# EAGLE design 3_Channel_Preprocessor (EAGLE 8.0.0)
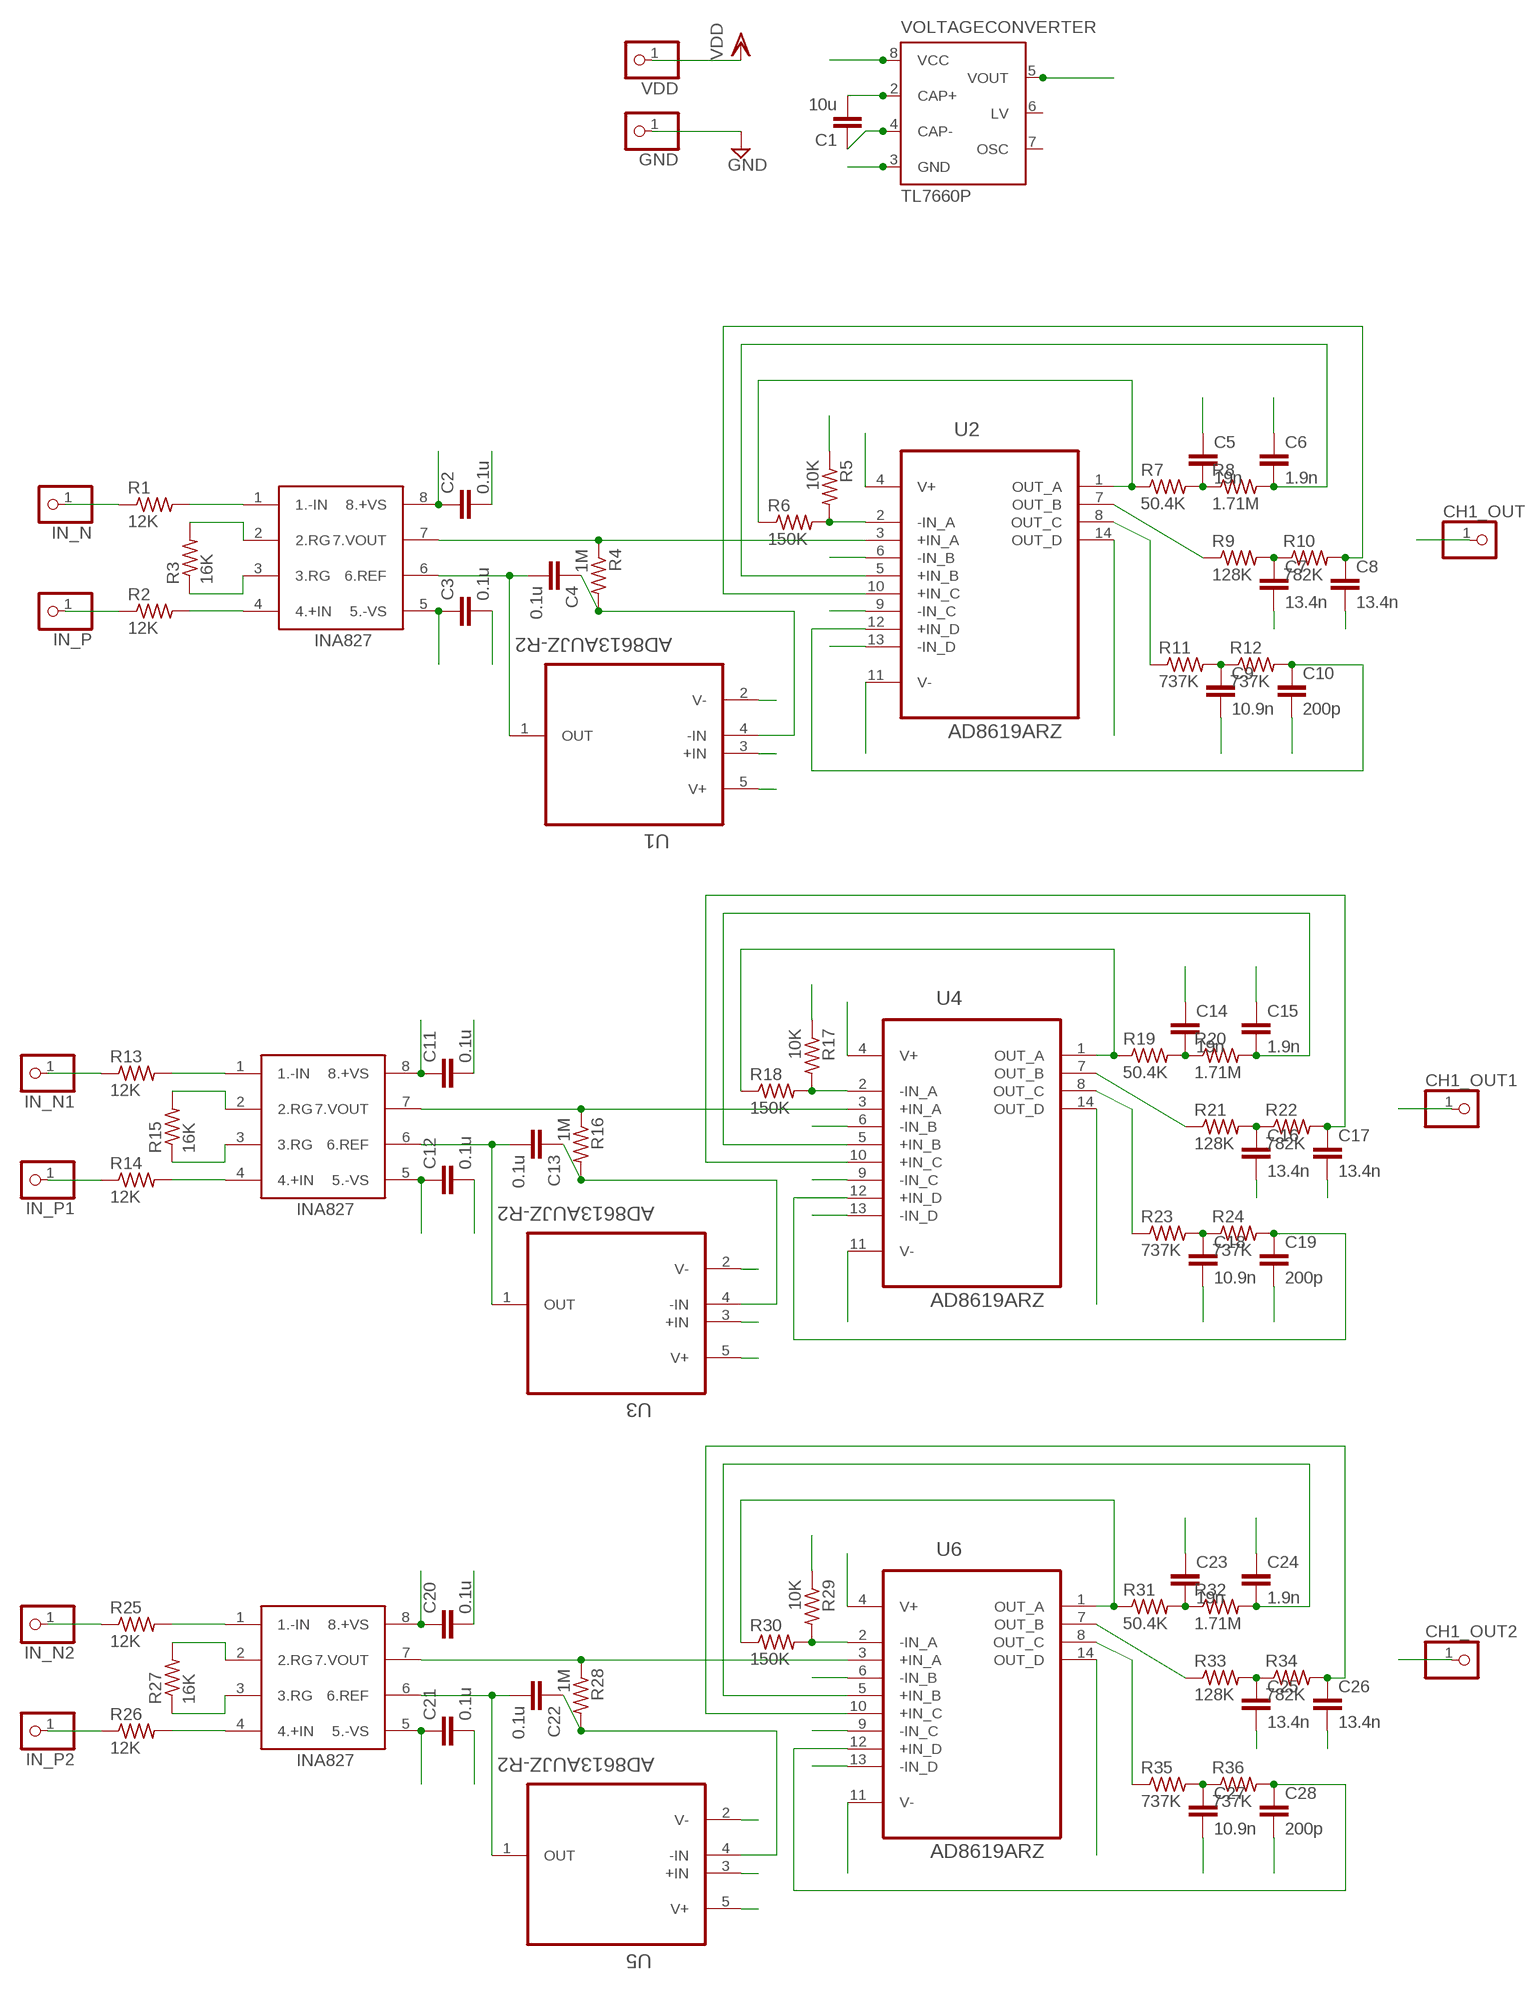
[diagram p0: schematic, sheet 1]

## Parts
C1  10u  C-EUC1206  [C1206]
C2  0.1u  C-EUC1206  [C1206]
C3  0.1u  C-EUC1206  [C1206]
C4  0.1u  C-EUC1206  [C1206]
C5  19n  C-EUC1206  [C1206]
C6  1.9n  C-EUC1206  [C1206]
C7  13.4n  C-EUC1206  [C1206]
C8  13.4n  C-EUC1206  [C1206]
C9  10.9n  C-EUC1206  [C1206]
C10  200p  C-EUC1206  [C1206]
C11  0.1u  C-EUC1206  [C1206]
C12  0.1u  C-EUC1206  [C1206]
C13  0.1u  C-EUC1206  [C1206]
C14  19n  C-EUC1206  [C1206]
C15  1.9n  C-EUC1206  [C1206]
C16  13.4n  C-EUC1206  [C1206]
C17  13.4n  C-EUC1206  [C1206]
C18  10.9n  C-EUC1206  [C1206]
C19  200p  C-EUC1206  [C1206]
C20  0.1u  C-EUC1206  [C1206]
C21  0.1u  C-EUC1206  [C1206]
C22  0.1u  C-EUC1206  [C1206]
C23  19n  C-EUC1206  [C1206]
C24  1.9n  C-EUC1206  [C1206]
C25  13.4n  C-EUC1206  [C1206]
C26  13.4n  C-EUC1206  [C1206]
C27  10.9n  C-EUC1206  [C1206]
C28  200p  C-EUC1206  [C1206]
CH1_OUT  PINHD-1X1  [1X01]
CH1_OUT1  PINHD-1X1  [1X01]
CH1_OUT2  PINHD-1X1  [1X01]
GND  PINHD-1X1  [1X01]
IN_N  PINHD-1X1  [1X01]
IN_N1  PINHD-1X1  [1X01]
IN_N2  PINHD-1X1  [1X01]
IN_P  PINHD-1X1  [1X01]
IN_P1  PINHD-1X1  [1X01]
IN_P2  PINHD-1X1  [1X01]
INA1  INA827  [INA827]
R1  12K  R-US_M1206  [M1206]
R2  12K  R-US_M1206  [M1206]
R3  16K  R-US_M1206  [M1206]
R4  1M  R-US_M1206  [M1206]
R5  10K  R-US_M1206  [M1206]
R6  150K  R-US_M1206  [M1206]
R7  50.4K  R-US_M1206  [M1206]
R8  1.71M  R-US_M1206  [M1206]
R9  128K  R-US_M1206  [M1206]
R10  782K  R-US_M1206  [M1206]
R11  737K  R-US_M1206  [M1206]
R12  737K  R-US_M1206  [M1206]
R13  12K  R-US_M1206  [M1206]
R14  12K  R-US_M1206  [M1206]
R15  16K  R-US_M1206  [M1206]
R16  1M  R-US_M1206  [M1206]
R17  10K  R-US_M1206  [M1206]
R18  150K  R-US_M1206  [M1206]
R19  50.4K  R-US_M1206  [M1206]
R20  1.71M  R-US_M1206  [M1206]
R21  128K  R-US_M1206  [M1206]
R22  782K  R-US_M1206  [M1206]
R23  737K  R-US_M1206  [M1206]
R24  737K  R-US_M1206  [M1206]
R25  12K  R-US_M1206  [M1206]
R26  12K  R-US_M1206  [M1206]
R27  16K  R-US_M1206  [M1206]
R28  1M  R-US_M1206  [M1206]
R29  10K  R-US_M1206  [M1206]
R30  150K  R-US_M1206  [M1206]
R31  50.4K  R-US_M1206  [M1206]
R32  1.71M  R-US_M1206  [M1206]
R33  128K  R-US_M1206  [M1206]
R34  782K  R-US_M1206  [M1206]
R35  737K  R-US_M1206  [M1206]
R36  737K  R-US_M1206  [M1206]
U1  AD8613AUJZ-R2  [SOT95P280X100-5N]
U2  AD8619ARZ  [SOIC127P600X175-14N]
U3  AD8613AUJZ-R2  [SOT95P280X100-5N]
U4  AD8619ARZ  [SOIC127P600X175-14N]
U5  AD8613AUJZ-R2  [SOT95P280X100-5N]
U6  AD8619ARZ  [SOIC127P600X175-14N]
U$2  INA827  [INA827]
U$3  INA827  [INA827]
VDD  PINHD-1X1  [1X01]
VOLTAGECONVERTER  TL7660P  [DIL08]

## Nets
GND: C2.2 C3.2 C6.1 C8.2 C10.2 C11.2 C12.2 C15.1 C17.2 C19.2 C20.2 C21.2 C24.1 C26.2 C28.2 GND.1 R5.1 R17.1 R29.1 U1.3(+IN) U3.3(+IN) U5.3(+IN) VOLTAGECONVERTER.3(GND)
IN_N: IN_N.1 R1.1
IN_N1: IN_N1.1 R13.1
IN_N2: IN_N2.1 R25.1
IN_P: IN_P.1 R2.1
IN_P1: IN_P1.1 R14.1
IN_P2: IN_P2.1 R26.1
N$1: C1.2 VOLTAGECONVERTER.2(CAP+)
N$2: C1.1 VOLTAGECONVERTER.4(CAP-)
N$3: INA1.1(1.-IN) R1.2
N$4: INA1.4(4.+IN) R2.2
N$5: INA1.2(2.RG) R3.2
N$6: INA1.3(3.RG) R3.1
N$7: C4.2 INA1.6(6.REF) U1.1(OUT)
N$8: INA1.7(7.VOUT) R4.1 U2.3(+IN_A)
N$9: C4.1 R4.2 U1.4(-IN)
N$10: R5.2 R6.2 U2.2(-IN_A)
N$11: R6.1 R7.1 U2.1(OUT_A)
N$12: C5.2 R7.2 R8.1
N$13: C6.2 R8.2 U2.5(+IN_B)
N$14: C7.1 R9.2 R10.1
N$15: C8.1 R10.2 U2.10(+IN_C)
N$16: C9.1 R11.2 R12.1
N$17: C10.1 R12.2 U2.12(+IN_D)
N$18: R13.2 U$2.1(1.-IN)
N$19: R14.2 U$2.4(4.+IN)
N$20: R15.2 U$2.2(2.RG)
N$21: R15.1 U$2.3(3.RG)
N$22: C13.2 U3.1(OUT) U$2.6(6.REF)
N$23: R16.1 U4.3(+IN_A) U$2.7(7.VOUT)
N$24: C13.1 R16.2 U3.4(-IN)
N$25: R17.2 R18.2 U4.2(-IN_A)
N$26: R18.1 R19.1 U4.1(OUT_A)
N$27: C14.2 R19.2 R20.1
N$28: C15.2 R20.2 U4.5(+IN_B)
N$29: C16.1 R21.2 R22.1
N$30: C17.1 R22.2 U4.10(+IN_C)
N$31: C18.1 R23.2 R24.1
N$32: C19.1 R24.2 U4.12(+IN_D)
N$33: R25.2 U$3.1(1.-IN)
N$34: R26.2 U$3.4(4.+IN)
N$35: R27.2 U$3.2(2.RG)
N$36: R27.1 U$3.3(3.RG)
N$37: C22.2 U5.1(OUT) U$3.6(6.REF)
N$38: R28.1 U6.3(+IN_A) U$3.7(7.VOUT)
N$39: C22.1 R28.2 U5.4(-IN)
N$40: R29.2 R30.2 U6.2(-IN_A)
N$41: R30.1 R31.1 U6.1(OUT_A)
N$42: C23.2 R31.2 R32.1
N$43: C24.2 R32.2 U6.5(+IN_B)
N$44: C25.1 R33.2 R34.1
N$45: C26.1 R34.2 U6.10(+IN_C)
N$46: C27.1 R35.2 R36.1
N$47: C28.1 R36.2 U6.12(+IN_D)
OUT_B: C5.1 R9.1 U2.6(-IN_B) U2.7(OUT_B)
OUT_B1: C14.1 R21.1 U4.6(-IN_B) U4.7(OUT_B)
OUT_B2: C23.1 R33.1 U6.6(-IN_B) U6.7(OUT_B)
OUT_C: C7.2 R11.1 U2.8(OUT_C) U2.9(-IN_C)
OUT_C1: C16.2 R23.1 U4.8(OUT_C) U4.9(-IN_C)
OUT_C2: C25.2 R35.1 U6.8(OUT_C) U6.9(-IN_C)
OUT_D: C9.2 CH1_OUT.1 U2.13(-IN_D) U2.14(OUT_D)
OUT_D1: C18.2 CH1_OUT1.1 U4.13(-IN_D) U4.14(OUT_D)
OUT_D2: C27.2 CH1_OUT2.1 U6.13(-IN_D) U6.14(OUT_D)
VDD: C2.1 C11.1 C20.1 INA1.8(8.+VS) U1.5(V+) U2.4(V+) U3.5(V+) U4.4(V+) U5.5(V+) U6.4(V+) U$2.8(8.+VS) U$3.8(8.+VS) VDD.1 VOLTAGECONVERTER.8(VCC)
VDD-: C3.1 C12.1 C21.1 INA1.5(5.-VS) U1.2(V-) U2.11(V-) U3.2(V-) U4.11(V-) U5.2(V-) U6.11(V-) U$2.5(5.-VS) U$3.5(5.-VS) VOLTAGECONVERTER.5(VOUT)
Unconnected: VOLTAGECONVERTER.6(LV) VOLTAGECONVERTER.7(OSC)

## Library data of the parts
C1-C28 = rcl:C-EU: CAPACITOR, European symbol
CH1_OUT CH1_OUT1 CH1_OUT2 GND IN_N IN_N1 IN_N2 IN_P IN_P1 IN_P2 VDD = pinhead:PINHD-1X1: PIN HEADER
INA1 U$2 U$3 = INA827:INA827
R1-R36 = rcl:R-US_: RESISTOR, American symbol
U1 U3 U5 = AD8613AUJZ-R2:AD8613AUJZ-R2: Input/Output Operational Amplifiers; AVAILABILITY: Good; DESCRIPTION: OPERATIONAL AMPLIFIER, 400KHZ, 0.1V/ us, TSOT-23-5; MF: Analog Devices; MP: AD8613AUJZ-R2; PACKAGE: SOT-23-5 Analog Devices; PRICE: 1.17 USD
U2 U4 U6 = AD8619ARZ:AD8619ARZ: Operational Amplifiers; AVAILABILITY: Good; DESCRIPTION: OP Amp Quad GP R-R I/O ???}2.5V/5V 14-Pin SOIC N Tube; MF: Analog Devices; MP: AD8619ARZ; PACKAGE: SOIC-14 Analog Devices; PRICE: 1.96 USD
VOLTAGECONVERTER = texas:TL7660: CMOS VOLTAGE CONVERTER Source: http://focus.ti.com/lit/ds/scas794/scas794.pdf; MPN: TL7660CP; OC_FARNELL: 1755283; OC_NEWARK: 14M2447

## Board
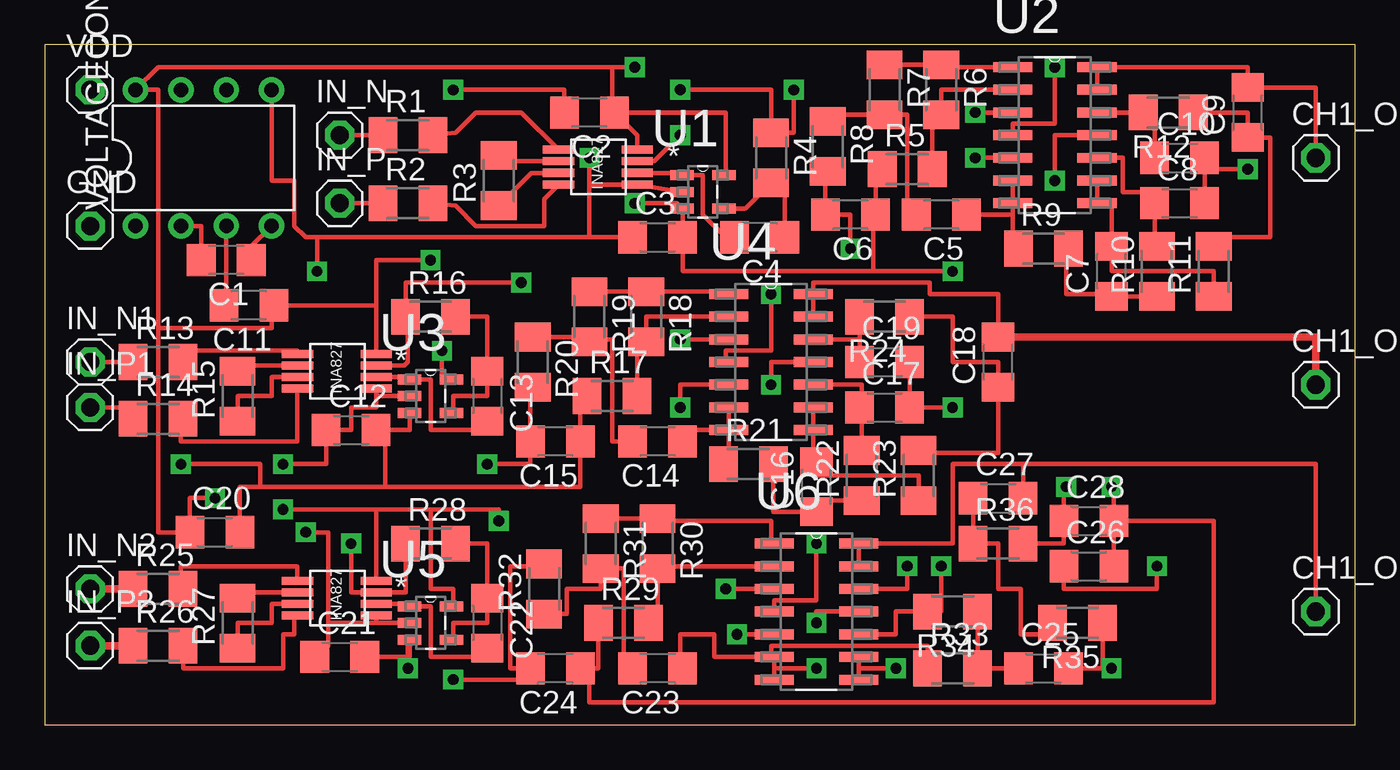
[diagram p1: board, top side]
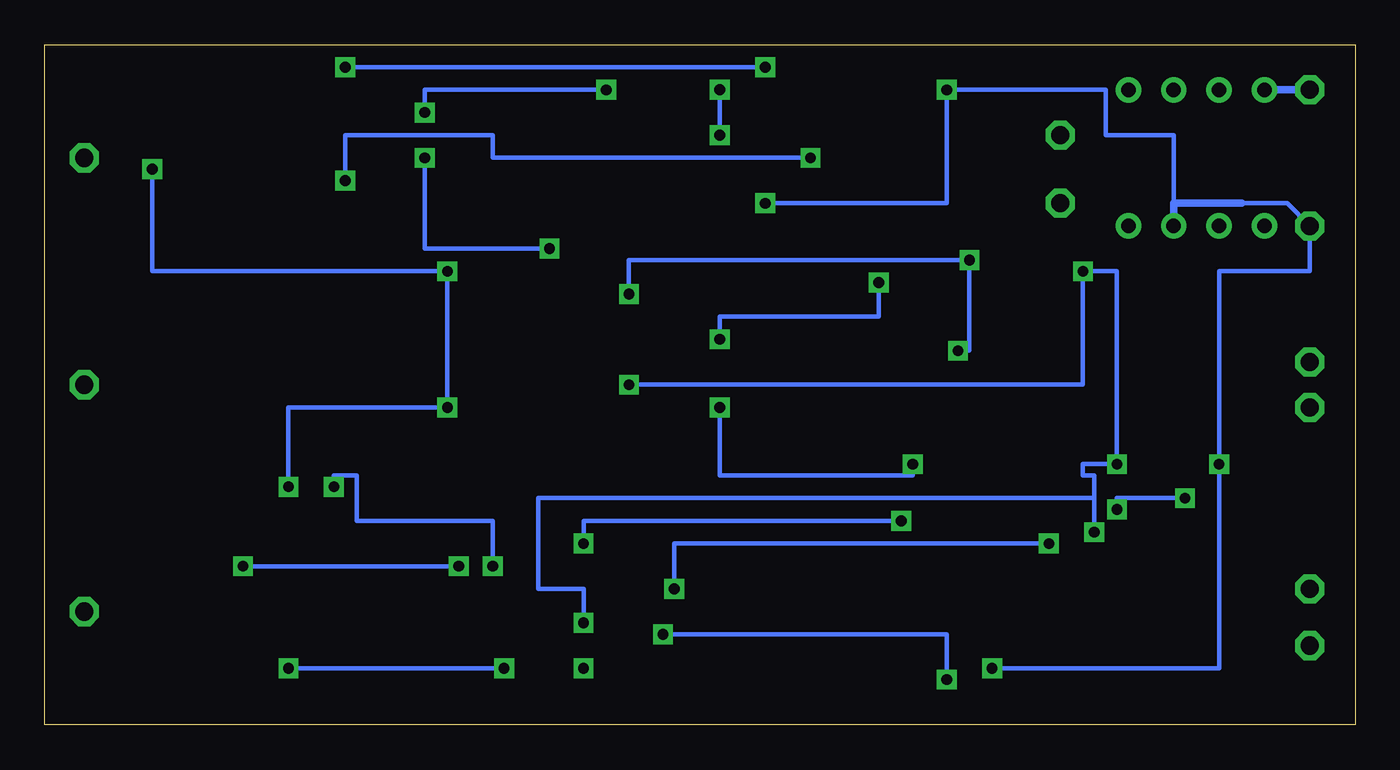
[diagram p2: board, bottom side, seen from below]

Size 73.33 x 38.09 mm. Coordinates in mm from the lower left corner, seen from the top.
Outline: 0,0 73.33,0 73.33,38.09 0,38.09 0,0
Copper layers (1*16): Top 0.035mm / dielectric 1.5mm / Bottom 0.035mm
Design rules "AdvancedCircuitsBarebones": minimum track width 6mil, minimum drill 20mil, track to track 6mil, track to pad 6mil, pad to pad 6mil, via to via 6mil, smd to smd 6mil, copper to edge 10mil, drill to drill 6mil, minimum pad ring 12mil, minimum via ring 10mil, stop-mask expansion 4mil, vias tented up to drill 25mil, thermal gap 10mil

### Footprints (pad centres in the part's own frame; a part is rotated, then mirrored left to right if it is on the bottom)
C1206 = smd 1.6 x 1.8: 1 -1.4,0; 2 1.4,0
1X01 = drill 1.016 octagon: 1 0,0
INA827 = smd 1.75 x 0.45: 1 -3,3; 2 -3,2.35; 3 -3,1.7; 4 -3,1.05; 5 1.4,1.05; 6 1.4,1.7; 7 1.4,2.35; 8 1.4,3
M1206 = smd 1.6 x 2: 1 -1.4,0; 2 1.4,0
SOT95P280X100-5N = smd 1.321 x 0.559: 1 -1.168,0.94; 2 -1.168,0; 3 -1.168,-0.94; 4 1.168,-0.94; 5 1.168,0.94
SOIC127P600X175-14N = smd 2.184 x 0.559: 1 -2.362,3.81; 2 -2.362,2.54; 3 -2.362,1.27; 4 -2.362,0; 5 -2.362,-1.27; 6 -2.362,-2.54; 7 -2.362,-3.81; 8 2.362,-3.81; 9 2.362,-2.54; 10 2.362,-1.27; 11 2.362,0; 12 2.362,1.27; 13 2.362,2.54; 14 2.362,3.81
DIL08 = drill 0.813 pad 1.27: 1 -3.81,-3.81; 2 -1.27,-3.81; 3 1.27,-3.81; 4 3.81,-3.81; 5 3.81,3.81; 6 1.27,3.81; 7 -1.27,3.81; 8 -3.81,3.81

### Placement (x,y rotation side)
C1  10.16,26.03 180 top
C2  30.48,34.29 180 top
C3  34.29,27.31 0 top
C4  40.01,27.31 180 top
C5  50.16,28.58 180 top
C6  45.09,28.58 180 top
C7  59.69,25.4 90 top
C8  63.5,29.21 0 top
C9  67.31,34.29 90 top
C10  63.5,31.75 0 top
C11  11.43,23.5 180 top
C12  17.14,16.51 0 top
C13  24.77,18.42 270 top
C14  34.29,15.88 180 top
C15  28.57,15.88 180 top
C16  43.18,13.34 90 top
C17  46.99,17.78 0 top
C18  53.34,20.32 90 top
C19  46.99,20.32 0 top
C20  9.53,10.8 0 top
C21  16.51,3.81 0 top
C22  24.77,5.72 270 top
C23  34.29,3.18 180 top
C24  28.57,3.18 180 top
C25  55.88,3.18 0 top
C26  58.42,8.89 0 top
C27  53.34,12.7 0 top
C28  58.42,11.43 0 top
CH1_OUT  71.12,31.75 0 top
CH1_OUT1  71.12,19.05 0 top
CH1_OUT2  71.12,6.35 0 top
GND  2.54,27.94 0 top
IN_N  16.51,33.02 0 top
IN_N1  2.54,20.32 0 top
IN_N2  2.54,7.62 0 top
IN_P  16.51,29.21 0 top
IN_P1  2.54,17.78 0 top
IN_P2  2.54,4.45 0 top
INA1  31.75,29.21 0 top
R1  20.32,33.02 0 top
R2  20.32,29.21 0 top
R3  25.4,30.48 90 top
R4  40.64,31.75 270 top
R5  48.26,31.12 0 top
R6  50.16,35.56 270 top
R7  46.99,35.56 270 top
R8  43.81,32.39 270 top
R9  55.88,26.67 0 top
R10  62.23,25.4 90 top
R11  65.41,25.4 90 top
R12  62.87,34.29 180 top
R13  6.35,20.32 0 top
R14  6.35,17.15 0 top
R15  10.79,18.42 90 top
R16  21.59,22.86 0 top
R17  31.75,18.42 0 top
R18  33.66,22.86 270 top
R19  30.48,22.86 270 top
R20  27.3,20.32 270 top
R21  39.37,14.61 0 top
R22  45.72,13.97 90 top
R23  48.9,13.97 90 top
R24  46.99,22.86 180 top
R25  6.35,7.62 0 top
R26  6.35,4.45 0 top
R27  10.79,5.72 90 top
R28  21.59,10.16 0 top
R29  32.38,5.72 0 top
R30  34.29,10.16 270 top
R31  31.11,10.16 270 top
R32  27.94,7.62 90 top
R33  50.8,3.18 0 top
R34  50.8,6.35 180 top
R35  57.78,5.72 180 top
R36  53.34,10.16 0 top
U1  36.83,29.84 0 top
U2  56.52,33.02 0 top
U3  21.59,18.42 0 top
U4  40.64,20.32 0 top
U5  21.59,5.72 0 top
U6  43.18,6.35 0 top
U$2  17.14,17.78 0 top
U$3  17.14,5.08 0 top
VDD  2.54,35.56 0 top
VOLTAGECONVERTER  8.89,31.75 0 top

### Tracks (layer width: path | path; a pad name or v marks a point on that pad's centre or on a via)
GND  (via drill 0.6)
  Top 0.254: v22.86,35.56 29.08,35.56 C2.2 | v33.02,29.21 35.36,29.21 U1.3 35.69,28.91 C3.2 35.69,25.4 46.35,25.4 | R5.1 46.48,31.12 C6.1 46.35,28.58 46.35,25.4 | 46.35,25.4 v50.8,25.4 | C8.2 C10.2 64.9,31.12 v67.31,31.12 | C11.2 10.16,23.5 VOLTAGECONVERTER.3 | 19.05,16.51 20.42,16.51 U3.3 | 19.05,16.51 C12.2 | v7.62,14.61 12.06,14.61 12.06,13.34 | 19.05,13.34 12.06,13.34 | 19.05,13.34 29.98,13.34 C15.1 29.98,18.42 R17.1 | C19.2 C17.2 v50.8,17.78 | 12.06,13.34 10.93,13.34 C20.2 | R29.1 30.98,3.18 C24.1 30.48,3.18 30.48,1.27 65.41,1.27 65.41,11.43 C28.2 | v20.32,3.18 20.32,4.78 U5.3 20.42,3.81 C21.2 | C28.2 C26.2 | v59.69,13.34 59.82,13.34 C28.2 | C12.2 19.05,16.51 | 19.05,16.51 19.05,13.34 | C12.2 19.05,16.51
  Bottom 0.254: 10.16,29.21 10.16,33.02 13.97,33.02 13.97,35.56 v22.86,35.56 22.86,29.21 v33.02,29.21 | 6.35,29.21 3.81,29.21 GND.1 2.54,25.4 7.62,25.4 v7.62,14.61 7.62,3.18 v20.32,3.18 | v67.31,31.12 67.31,25.4 v50.8,25.4 v50.8,17.78 59.69,17.78 v59.69,13.34
  Bottom 0.406: 6.35,29.21 10.16,29.21 VOLTAGECONVERTER.3
IN_N
  Top 0.254: R1.1 IN_N.1
IN_N1
  Top 0.254: IN_N1.1 R13.1
IN_N2
  Top 0.406: IN_N2.1 R25.1
IN_P
  Top 0.254: R2.1 IN_P.1
IN_P1
  Top 0.254: IN_P1.1 4.95,17.78 R14.1
IN_P2
  Top 0.406: IN_P2.1 R26.1
N$1
  Top 0.254: VOLTAGECONVERTER.2 8.76,27.94 C1.2
N$2
  Top 0.254: C1.1 11.56,26.8 VOLTAGECONVERTER.4
N$3
  Top 0.254: R1.2 22.99,33.15 24.13,34.29 26.67,34.29 INA1.1
N$4
  Top 0.254: R2.2 22.99,29.08 24.13,27.94 27.94,27.94 27.94,29.45 INA1.4
N$5
  Top 0.254: INA1.2 25.72,31.56 R3.2
N$6
  Top 0.254: INA1.3 27.23,30.91 R3.1
N$7
  Top 0.254: 38.1,27.94 C4.2 38.1,27.31 36.83,28.58 36.83,30.78 U1.1 35.54,30.91 INA1.6
N$8  (via drill 0.6, 0.61)
  Top 0.254: INA1.7 34.1,31.56 v35.56,33.02 | v35.56,35.56 40.64,35.56 R4.1 41.91,33.15 v41.91,35.56 | v52.07,34.29 U2.3
  Bottom 0.254: v35.56,35.56 v35.56,33.02 | v41.91,35.56 52.07,35.56 v52.07,34.29
N$9
  Top 0.254: R4.2 41.41,29.84 | C4.1 41.41,29.59 R4.2 | U1.4 39.2,28.91 R4.2
N$10
  Top 0.254: R5.2 49.66,34.16 R6.2 50.16,35.56 U2.2
N$11
  Top 0.254: U2.1 50.16,36.83 R6.1 R7.1
N$12
  Top 0.254: R8.1 43.81,34.16 R7.2 48.26,34.16 48.26,27.94 48.77,27.94 C5.2
N$13  (via drill 0.6)
  Top 0.254: R8.2 43.69,30.98 C6.2 45.09,28.58 v45.09,26.67 | v52.07,31.75 U2.5
  Bottom 0.254: v45.09,26.67 52.07,26.67 v52.07,31.75
N$14
  Top 0.254: R9.2 57.15,26.67 57.15,24.13 59.69,24.13 C7.1 R10.1
N$15
  Top 0.254: R10.2 62.1,27.44 C8.1 62.1,29.84 60.33,29.84 60.33,31.75 U2.10
N$16
  Top 0.254: R11.2 65.41,27.31 68.58,27.31 68.58,32.89 C9.1 67.31,34.29 R12.1
N$17
  Top 0.254: U2.12 R12.2 62.1,34.29 C10.1
N$18
  Top 0.254: R13.2 7.62,20.32 7.62,20.96 14.14,20.96 U$2.1
N$19
  Top 0.254: R14.2 7.62,17.15 7.62,15.88 14.14,15.88 U$2.4
N$20
  Top 0.254: U$2.2 10.79,20.13 R15.2
N$21
  Top 0.254: U$2.3 12.7,19.48 12.7,18.42 11.43,18.42 | 11.43,18.42 10.79,18.42 | R15.1 10.79,18.42 | 10.79,18.42 11.43,18.42
N$22
  Top 0.254: U$2.6 20.42,19.48 U3.1 21.59,19.36 21.59,16.51 24.77,16.51 C13.2
N$23  (via drill 0.6)
  Top 0.254: U$2.7 20.13,20.13 20.32,20.32 20.32,22.86 R16.1 20.19,24.77 v26.67,24.77 | v35.56,21.59 U4.3
  Bottom 0.254: v26.67,24.77 26.67,22.86 35.56,22.86 v35.56,21.59
N$24
  Top 0.254: R16.2 24.77,22.86 C13.1 24.13,19.82 24.13,20.32 25.4,20.32 24.77,20.32 24.77,18.42 22.86,18.42 22.86,17.48 U3.4
N$25
  Top 0.254: R17.2 33.15,21.46 R18.2 33.66,22.86 U4.2
N$26
  Top 0.254: R19.1 R18.1 38.28,24.26 U4.1
N$27
  Top 0.254: R20.1 30.48,21.72 R19.2 30.48,21.59 31.75,21.59 31.75,15.88 C14.2 32.89,15.24
N$28  (via drill 0.6)
  Top 0.254: R20.2 27.18,18.92 C15.2 27.18,14.61 v24.77,14.61 | v35.56,17.78 35.56,19.05 U4.5
  Bottom 0.254: v24.77,14.61 24.77,13.97 35.56,13.97 v35.56,17.78
N$29
  Top 0.254: R22.1 43.18,12.57 C16.1 40.77,11.94 R21.2
N$30
  Top 0.254: R22.2 45.72,17.78 | 45.72,17.78 C17.1 45.72,17.78 | U4.10 45.72,19.05 45.72,17.78
N$31
  Top 0.254: R24.1 50.8,22.86 50.8,20.32 53.34,20.32 C18.1 53.34,15.24 48.9,15.24 R23.2
N$32
  Top 0.254: 45.59,21.59 R24.2 | 45.59,21.59 C19.1 | U4.12 45.59,21.59
N$33
  Top 0.254: R25.2 7.62,7.62 7.62,8.89 14.14,8.89 U$3.1
N$34
  Top 0.254: U$3.4 13.97,6.13 13.97,5.08 13.34,5.08 13.34,3.18 7.75,3.18 R26.2
N$35
  Top 0.254: U$3.2 10.79,7.43 R27.2
N$36
  Top 0.254: U$3.3 12.7,6.78 12.7,5.72 10.79,5.72 R27.1
N$37
  Top 0.254: U$3.6 20.42,6.78 U5.1 21.59,6.66 21.59,3.81 24.77,3.81 C22.2
N$38  (via drill 0.6)
  Top 0.254: R28.1 20.19,7.43 U$3.7 17.14,7.43 v17.14,10.16 | v38.1,7.62 U6.3
  Bottom 0.254: v17.14,10.16 38.1,10.16 v38.1,7.62
N$39
  Top 0.254: R28.2 24.77,10.16 C22.1 24.77,5.72 22.86,5.72 22.86,4.78 U5.4
N$40
  Top 0.254: R29.2 34.29,5.72 R30.2 34.29,8.89 U6.2
N$41
  Top 0.254: R31.1 R30.1 34.29,11.43 40.64,11.43 40.64,10.16 U6.1
N$42
  Top 0.254: R32.1 29.21,6.22 29.21,7.62 31.11,7.62 R31.2 32.38,8.76 32.38,3.18 C23.2
N$43  (via drill 0.6)
  Top 0.254: R32.2 27.94,8.89 26.04,8.89 26.04,3.18 C24.2 27.3,3.18 27.3,2.54 v22.86,2.54 | U6.5 v38.73,5.08
  Bottom 0.254: v38.73,5.08 22.86,5.08 v22.86,2.54
N$44
  Top 0.254: C25.1 R33.2 R34.1
N$45  (via drill 0.6)
  Top 0.254: U6.10 47.62,5.08 47.62,6.35 R34.2 50.16,6.35 v50.16,8.89 | v62.23,8.89 62.23,7.62 57.02,7.62 C26.1
  Bottom 0.254: v50.16,8.89 v62.23,8.89
N$46
  Top 0.254: C27.1 R36.1 53.34,10.16 53.34,7.62 54.61,7.62 54.61,5.08 56.38,5.08 R35.2
N$47  (via drill 0.6)
  Top 0.254: R36.2 57.02,10.16 C28.1 57.02,13.34 v57.15,13.34 | U6.12 48.26,7.62 v48.26,8.89
  Bottom 0.254: v48.26,8.89 48.26,11.43 55.88,11.43 55.88,13.97 57.15,13.97 v57.15,13.34
OUT_B
  Top 0.254: 54.15,28.58 C5.1 | 54.15,28.58 U2.7 U2.6 | R9.1 54.15,26.67 54.15,28.58
OUT_B1
  Top 0.254: U4.7 U4.6 | U4.7 35.56,16.51 35.69,16.51 C14.1 | R21.1 38.28,14.61 U4.7
OUT_B2  (via drill 0.6)
  Top 0.254: 35.69,2.54 C23.1 35.56,3.18 35.56,5.08 37.47,5.08 37.47,3.81 U6.6 | U6.6 40.82,3.18 | U6.6 40.64,3.81 40.64,4.45 49.4,4.45 R33.1 | U6.7 40.82,3.18 | 40.82,3.18 v43.18,3.18
OUT_C
  Top 0.254: U2.9 U2.8 59.69,29.21 C7.2 59.69,25.4 65.41,25.4 R11.1
OUT_C1
  Top 0.254: C16.2 43,14.74 | C16.2 43.18,13.97 48.9,13.97 R23.1 | U4.9 U4.8 43,14.74 | 43,14.74 C16.2
OUT_C2  (via drill 0.6)
  Top 0.254: 45.54,3.18 U6.9 45.54,3.18 | 45.54,3.18 U6.8 | U6.8 45.54,3.18 | U6.8 45.54,3.18 | U6.8 45.54,3.18 | U6.8 45.54,3.18 | 45.54,3.18 v47.62,3.18 | R35.1 59.19,3.18 v59.69,3.18 C25.2
  Bottom 0.254: v47.62,3.18 v59.69,3.18
OUT_D
  Top 0.254: U2.13 U2.14 67.31,36.83 C9.2 71.12,35.69 CH1_OUT.1
OUT_D1
  Top 0.254: U4.13 U4.14 43,24.77 49.53,24.77 49.53,24.13 53.34,24.13 C18.2
  Top 0.406: C18.2 71.12,21.72 CH1_OUT1.1
OUT_D2
  Top 0.254: U6.13 U6.14 50.8,10.16 50.8,14.61 54.61,14.61 | 54.61,14.61 54.74,14.61 C27.2 | 54.61,14.61 71.12,14.61 CH1_OUT2.1
VDD  (via drill 0.6)
  Top 0.254: 31.75,36.83 6.35,36.83 VOLTAGECONVERTER.8 6.35,35.56 6.35,22.23 | 31.75,36.83 31.75,34.42 C2.1 | INA1.8 33.15,33.02 C2.1 | 31.75,36.83 v33.02,36.83 | C2.1 38.1,34.29 38.1,30.89 U1.5 | v56.52,36.83 56.52,33.66 54.15,33.66 U2.4 | 18.55,23.5 C11.1 12.7,23.5 12.7,22.23 6.35,22.23 | 18.55,23.5 U$2.8 | 18.55,23.5 18.55,26.03 v21.59,26.03 | v22.23,20.96 22.23,19.36 U3.5 | v40.64,24.13 40.64,20.96 38.1,20.96 38.1,20.32 U4.4 | U$3.8 18.55,12.07 | v13.34,12.07 18.55,12.07 | 18.55,12.07 21.59,12.07 | 21.59,12.07 21.59,7.62 22.86,7.62 22.86,6.66 U5.5 | 21.59,12.07 25.4,12.07 v25.4,11.43 | v43.18,10.16 43.18,6.99 40.82,6.99 U6.4 | v9.53,12.7 8.12,12.7 C20.1 6.35,10.8 6.35,22.23
  Bottom 0.254: v33.02,36.83 v56.52,36.83 | v22.23,20.96 21.59,20.96 v21.59,26.03 40.64,26.03 v40.64,24.13 | v9.53,12.7 13.34,12.7 v13.34,12.07 | v25.4,11.43 43.18,11.43 v43.18,10.16
  Bottom 0.406: VOLTAGECONVERTER.8 VDD.1
VDD-  (via drill 0.6)
  Top 0.254: VOLTAGECONVERTER.5 12.7,30.48 13.97,30.48 13.97,27.94 14.61,27.31 15.24,27.31 | 30.48,27.31 15.24,27.31 | 30.48,27.31 C3.1 | U1.2 INA1.5 30.48,30.26 | 30.48,30.26 30.48,27.31 | 30.48,30.26 v30.48,31.75 | v56.52,30.48 56.52,33.02 U2.11 | 15.24,27.31 v15.24,25.4 | v13.34,14.61 15.74,14.61 C12.1 17.14,16.51 17.14,17.78 18.55,17.78 U$2.5 18.55,18.42 U3.2 | v40.64,19.05 40.64,20.32 U4.11 | U5.2 18.55,5.72 | 18.55,5.72 U$3.5 18.55,5.72 | v14.61,10.8 15.88,10.8 15.88,5.72 | 15.88,5.72 15.88,4.45 15.11,4.45 C21.1 | 18.55,5.72 15.88,5.72 | v43.18,5.72 43.18,6.35 U6.11
  Bottom 0.254: v30.48,31.75 48.26,31.75 48.26,33.02 56.52,33.02 v56.52,30.48 | v40.64,19.05 15.24,19.05 v15.24,25.4 13.34,25.4 v13.34,14.61 15.24,14.61 15.24,13.97 14.61,13.97 14.61,12.7 | 14.61,12.7 v14.61,10.8 14.61,12.7 | 14.61,12.7 45.72,12.7 45.72,7.62 43.18,7.62 v43.18,5.72